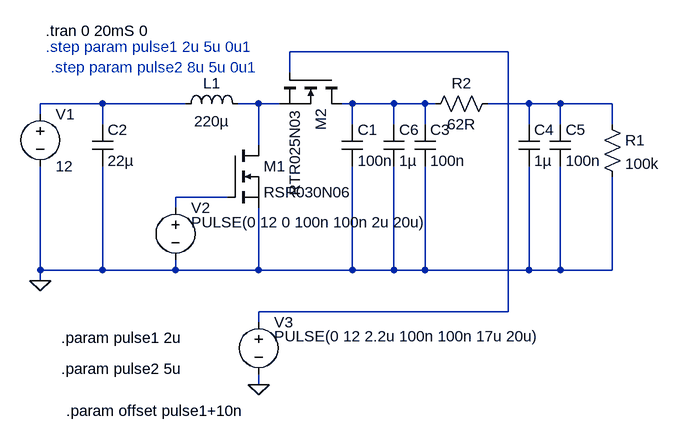
[diagram p0: schematic boost_converter_40V.asc]
boost_converter_40V.asc, the LTspice schematic file:
Version 4
SHEET 1 1184 760
WIRE 944 192 608 192
WIRE 608 224 608 192
WIRE 320 272 224 272
WIRE 448 272 320 272
WIRE 560 272 528 272
WIRE 592 272 560 272
WIRE 704 272 688 272
WIRE 768 272 704 272
WIRE 816 272 768 272
WIRE 832 272 816 272
WIRE 976 272 912 272
WIRE 1024 272 976 272
WIRE 1104 272 1024 272
WIRE 224 288 224 272
WIRE 320 304 320 272
WIRE 704 304 704 272
WIRE 768 304 768 272
WIRE 816 304 816 272
WIRE 976 304 976 272
WIRE 1024 304 1024 272
WIRE 1104 304 1104 272
WIRE 560 336 560 272
WIRE 512 416 432 416
WIRE 432 432 432 416
WIRE 224 528 224 368
WIRE 320 528 320 368
WIRE 320 528 224 528
WIRE 432 528 432 512
WIRE 432 528 320 528
WIRE 560 528 560 432
WIRE 560 528 432 528
WIRE 704 528 704 368
WIRE 704 528 560 528
WIRE 768 528 768 368
WIRE 768 528 704 528
WIRE 816 528 816 368
WIRE 816 528 768 528
WIRE 976 528 976 368
WIRE 976 528 816 528
WIRE 1024 528 1024 368
WIRE 1024 528 976 528
WIRE 1104 528 1104 384
WIRE 1104 528 1024 528
WIRE 224 544 224 528
WIRE 944 592 944 192
WIRE 944 592 560 592
WIRE 560 608 560 592
WIRE 560 704 560 688
FLAG 224 544 0
FLAG 560 704 0
SYMBOL cap 688 304 R0
SYMATTR InstName C1
SYMATTR Value 100n
SYMATTR SpiceLine Rser=60m Lser=0 mfg="   ---" pn="   ---" type="   ---"
SYMBOL cap 304 304 R0
SYMATTR InstName C2
SYMATTR Value 22µ
SYMATTR SpiceLine Rser=0 Lser=0 mfg="Murata" pn="GRM32ER71E226ME15" type="X7R"
SYMBOL ind 432 288 R270
WINDOW 0 32 56 VTop 2
WINDOW 3 5 56 VBottom 2
SYMATTR InstName L1
SYMATTR Value 220µ
SYMATTR SpiceLine Ipk=80m Rser=11.8 Cpar=0 mfg="   ---" pn="   ---"
SYMBOL nmos 512 336 R0
SYMATTR InstName M1
SYMATTR Value RSR030N06
SYMBOL voltage 224 272 R0
SYMATTR InstName V1
SYMATTR Value 12
SYMATTR SpiceLine Rser=0.1
SYMBOL res 1088 288 R0
SYMATTR InstName R1
SYMATTR Value 100k
SYMBOL voltage 432 416 R0
WINDOW 3 24 38 Left 2
SYMATTR Value PULSE(0 12 0 100n 100n 2u 20u)
SYMATTR InstName V2
SYMATTR SpiceLine Rser=0.1
SYMBOL voltage 560 592 R0
WINDOW 3 24 38 Left 2
SYMATTR Value PULSE(0 12 2.2u 100n 100n 17u 20u)
SYMATTR InstName V3
SYMATTR SpiceLine Rser=0.1
SYMBOL nmos 688 224 R90
SYMATTR InstName M2
SYMATTR Value RTR025N03
SYMBOL cap 800 304 R0
SYMATTR InstName C3
SYMATTR Value 100n
SYMATTR SpiceLine Rser=60m Lser=0 mfg="   ---" pn="   ---" type="   ---"
SYMBOL cap 1008 304 R0
SYMATTR InstName C5
SYMATTR Value 100n
SYMATTR SpiceLine Rser=60m Lser=0 mfg="   ---" pn="   ---" type="   ---"
SYMBOL cap 960 304 R0
SYMATTR InstName C4
SYMATTR Value 1µ
SYMATTR SpiceLine Rser=60m Lser=0 mfg="   ---" pn="   ---" type="   ---"
SYMBOL cap 752 304 R0
SYMATTR InstName C6
SYMATTR Value 1µ
SYMATTR SpiceLine Rser=60m Lser=0 mfg="   ---" pn="   ---" type="   ---"
SYMBOL res 816 288 R270
WINDOW 0 32 56 VTop 2
WINDOW 3 0 56 VBottom 2
SYMATTR InstName R2
SYMATTR Value 62R
TEXT 232 160 Left 2 !.tran 0 20mS 0
TEXT 232 184 Left 2 ;.step param pulse1 2u 5u 0u1
TEXT 240 216 Left 2 ;.step param pulse2 8u 5u 0u1
TEXT 256 632 Left 2 !.param pulse1 2u
TEXT 256 680 Left 2 !.param pulse2 5u
TEXT 264 744 Left 2 !.param offset pulse1+10n

The netlist it stands for:
* boost_converter_40V.asc
C1 N004 0 100n Rser=60m Lser=0 mfg="   ---" pn="   ---" type="   ---"
C2 N002 0 22µ Rser=0 Lser=0 mfg="Murata" pn="GRM32ER71E226ME15" type="X7R"
L1 N002 N003 220µ Ipk=80m Rser=11.8 Cpar=0 mfg="   ---" pn="   ---"
M1 N003 N006 0 0 RSR030N06
V1 N002 0 12 Rser=0.1
R1 N005 0 100k
V2 N006 0 PULSE(0 12 0 100n 100n 2u 20u) Rser=0.1
V3 N001 0 PULSE(0 12 2.2u 100n 100n 17u 20u) Rser=0.1
M2 N004 N001 N003 N003 RTR025N03
C3 N004 0 100n Rser=60m Lser=0 mfg="   ---" pn="   ---" type="   ---"
C5 N005 0 100n Rser=60m Lser=0 mfg="   ---" pn="   ---" type="   ---"
C4 N005 0 1µ Rser=60m Lser=0 mfg="   ---" pn="   ---" type="   ---"
C6 N004 0 1µ Rser=60m Lser=0 mfg="   ---" pn="   ---" type="   ---"
R2 N004 N005 62R
.model NMOS NMOS
.model PMOS PMOS
.lib standard.mos
.tran 0 20mS 0
* .step param pulse1 2u 5u 0u1
* .step param pulse2 8u 5u 0u1
.param pulse1 2u
.param pulse2 5u
.param offset pulse1+10n
.backanno
.end